# Altium schematic sheet 3_ADSTM32-Peripheral.SchDoc
size A; SheetNumber: 4; SheetTotal: 4
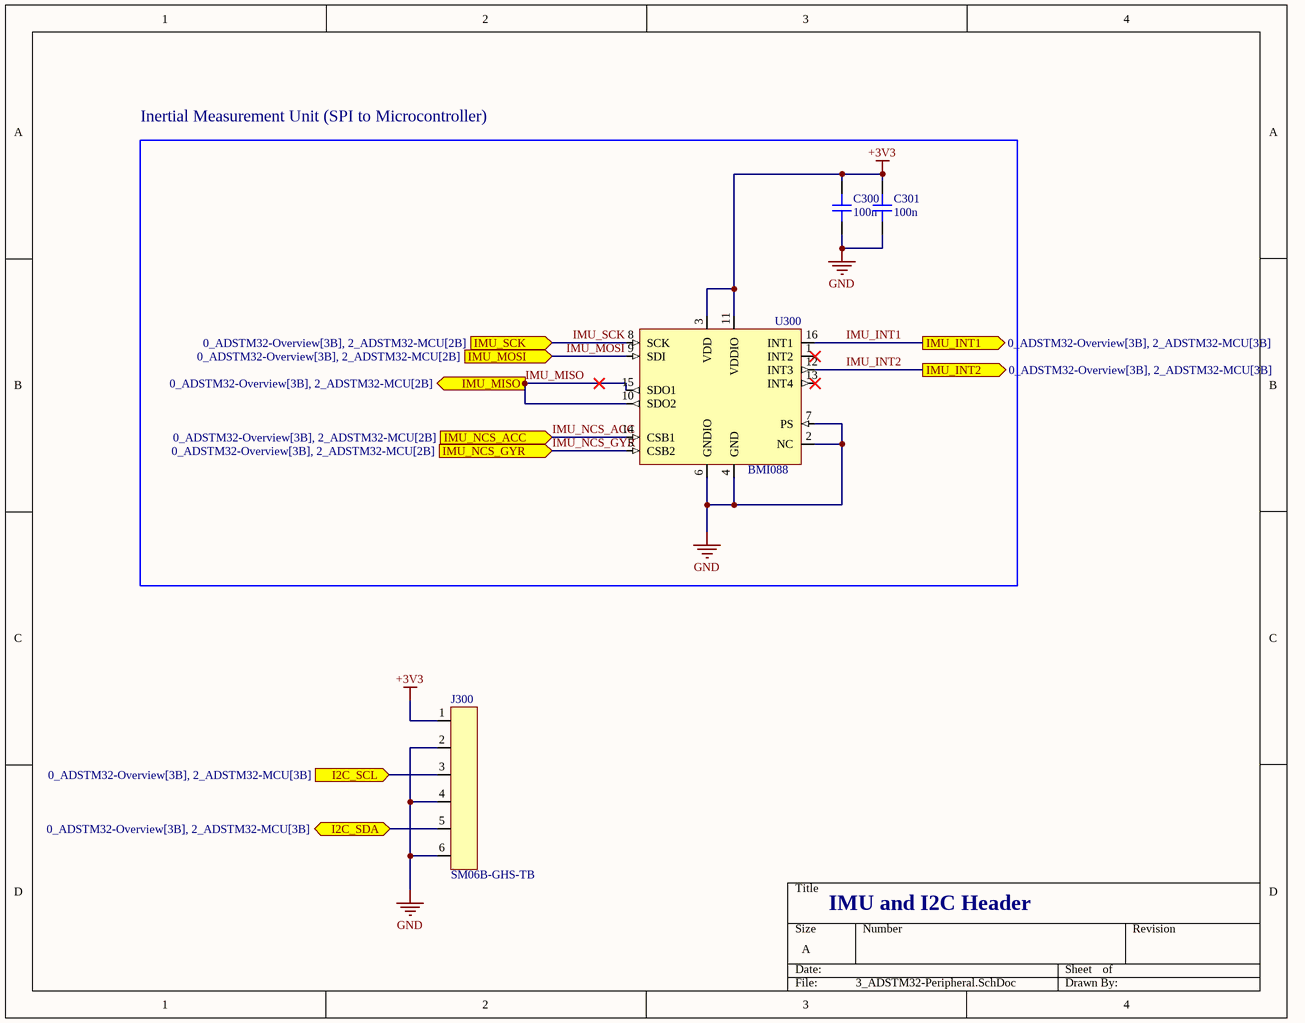
[diagram p0: 3_ADSTM32-Peripheral.SchDoc]

## Parts
C300  100n  [CAP_0603]
C301  100n  [CAP_0603]
J300  SM06B-GHS-TB  [SM06B-GHS-TB]
U300  BMI088  [BMI088]

## Blocks framed on the sheet
Inertial Measurement Unit (SPI to Microcontroller): C300 C301 U300

## Ports
I2C_SCL (in, see 0_ADSTM32-Overview[3B], 2_ADSTM32-MCU[3B]), I2C_SDA (bidir, see 0_ADSTM32-Overview[3B], 2_ADSTM32-MCU[3B]), IMU_INT1 (out, see 0_ADSTM32-Overview[3B], 2_ADSTM32-MCU[3B]), IMU_INT2 (out, see 0_ADSTM32-Overview[3B], 2_ADSTM32-MCU[3B]), IMU_MISO (out, see 0_ADSTM32-Overview[3B], 2_ADSTM32-MCU[2B]), IMU_MOSI (in, see 0_ADSTM32-Overview[3B], 2_ADSTM32-MCU[2B]), IMU_NCS_ACC (in, see 0_ADSTM32-Overview[3B], 2_ADSTM32-MCU[2B]), IMU_NCS_GYR (in, see 0_ADSTM32-Overview[3B], 2_ADSTM32-MCU[2B]), IMU_SCK (in, see 0_ADSTM32-Overview[3B], 2_ADSTM32-MCU[2B])

## Nets
+3V3: C300.2 C301.2 J300.1 U300.3(VDD) U300.11(VDDIO)
GND: C300.1 C301.1 J300.2 J300.4 J300.6 U300.2(NC) U300.4(GND) U300.6(GNDIO) U300.7(PS)
I2C_SCL: J300.3 ; port I2C_SCL
I2C_SDA: J300.5 ; port I2C_SDA
IMU_INT1: U300.16(INT1) ; port IMU_INT1
IMU_INT2: U300.12(INT3) ; port IMU_INT2
IMU_MISO: U300.10(SDO2) U300.15(SDO1) ; port IMU_MISO
IMU_MOSI: U300.9(SDI) ; port IMU_MOSI
IMU_NCS_ACC: U300.14(CSB1) ; port IMU_NCS_ACC
IMU_NCS_GYR: U300.5(CSB2) ; port IMU_NCS_GYR
IMU_SCK: U300.8(SCK) ; port IMU_SCK

Not connected (* = marked no-connect by the designer): U300 1(INT2)* 13(INT4)*

## Notes on the sheet
- IMU and I2C Header

## Library data of the parts
C300 C301 = CAP_0603: Capaictor SMD 0603 Generic; Manufacturer: *; Manufacturer Part Number: *; Tolerance: *; Voltage Rating: *; Dielectric: *
J300 = SM06B-GHS-TB: Header Connector 6 Position 1.25MM Pitch SMD Horizontal JST GH; Manufacturer: JST; Manufacturer Part Number: SM06B-GHS-TB; Distributor Link 1: https://www.digikey.co.uk/en/products/detail/jst-sales-america-inc/SM06B-GHS-TB/807790?srsltid=AfmBOopuWliyuZMmwFQasP26N8UGWQ-544t8Du2hpq1pUTE7HfB37_20; Distributor Link 2: https://eu.mouser.com/ProductDetail/JST-Commercial/SM06B-GHS-TBLFSN?qs=dbcCsuKDzFVtzW8gaymizQ==&srsltid=AfmBOopZ7IaGkbagz-tGgYVZR08OuGz3rY7I5JdStK1xvGH3CZodfjQn&_gl=1*1e23q4v*_ga*dW5kZWZpbmVk*_ga_15W4STQT4T*dW5kZWZpbmVk*_ga_1KQLCYKRX3*dW5kZWZpbmVk
U300 = BMI088: Inertial Measurement Unit (IMU) 6-axis 16bit; Manufacturer: Bosch; Manufacturer Part Number: BMI088; Distributor link: https://eu.mouser.com/ProductDetail/Bosch-Sensortec/BMI088?qs=f9yNj16SXrIMFspTV6RB6Q%3D%3D